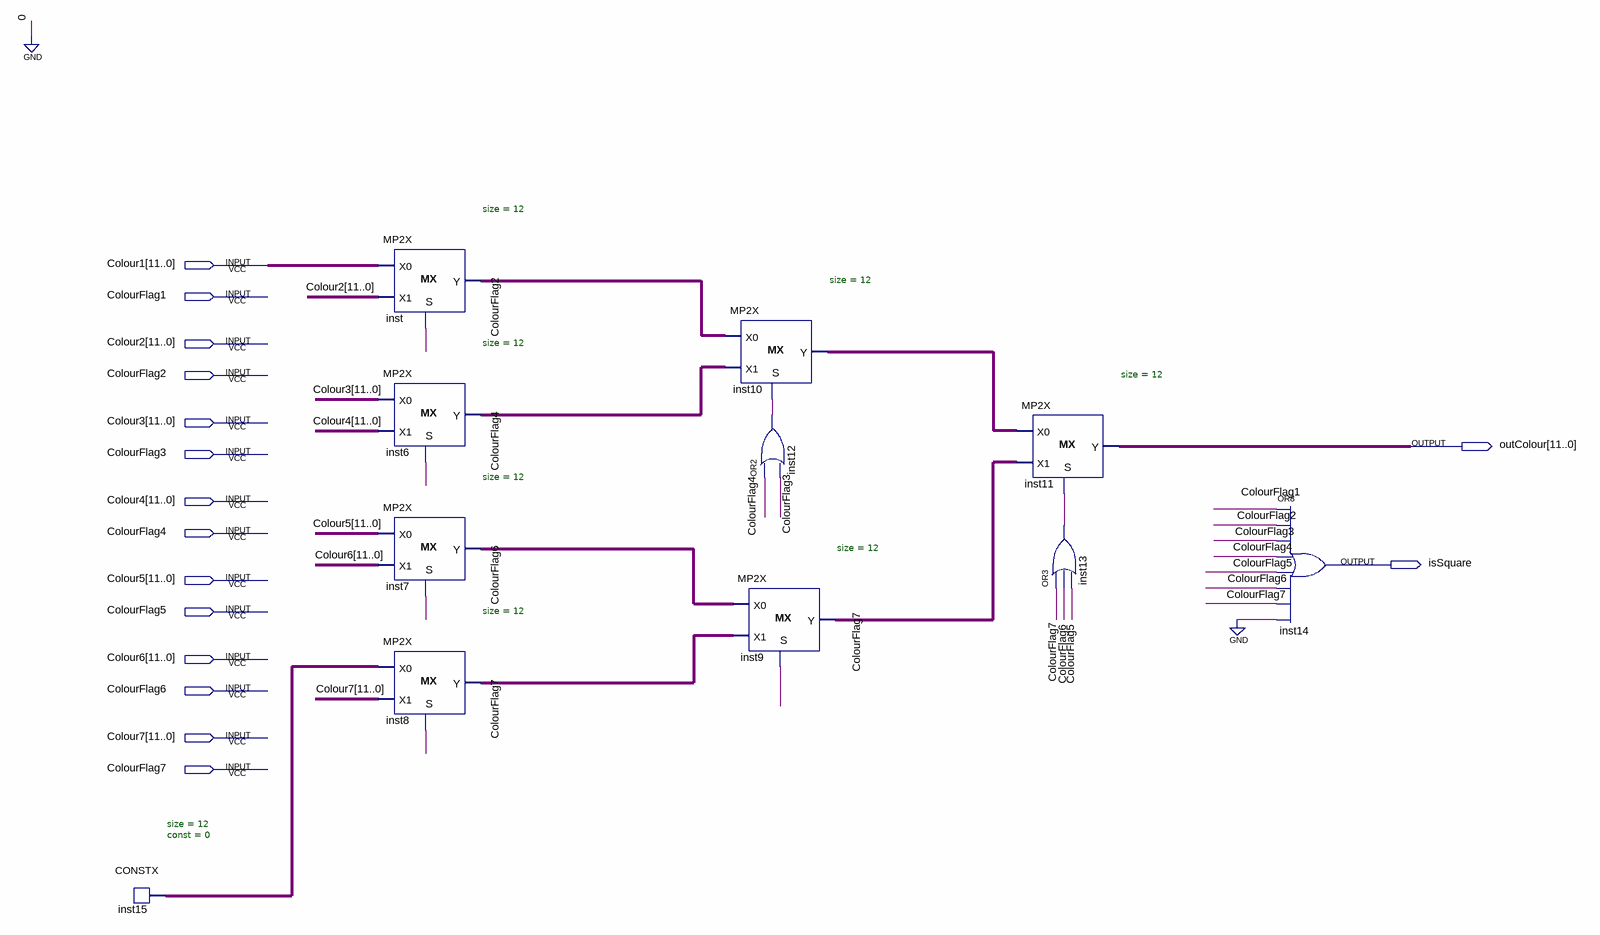
[diagram p0: schematic sheet]
// Quartus schematic MP8.bdf as structural Verilog: 11 symbols, 16 pins
module MP8 (
  input  [11:0] Colour1,
  input  ColourFlag1,
  input  [11:0] Colour2,
  input  ColourFlag2,
  input  [11:0] Colour3,
  input  ColourFlag3,
  input  [11:0] Colour4,
  input  ColourFlag4,
  input  [11:0] Colour5,
  input  ColourFlag5,
  input  [11:0] Colour6,
  input  ColourFlag6,
  input  [11:0] Colour7,
  input  ColourFlag7,
  output [11:0] outColour,
  output isSquare
);

  wire inst12_out, inst13_out;
  wire [11:0] inst6_y, inst7_y, inst8_y, inst9_y, inst10_y, inst15_data, inst_y;

  CONSTX #(.size(12), .\const (0)) inst15 (.data(inst15_data));
  MP2X #(.size(12)) inst (.S(ColourFlag2), .X0(Colour1), .X1(Colour2), .Y(inst_y));
  MP2X #(.size(12)) inst6 (.S(ColourFlag4), .X0(Colour3), .X1(Colour4), .Y(inst6_y));
  MP2X #(.size(12)) inst7 (.S(ColourFlag6), .X0(Colour5), .X1(Colour6), .Y(inst7_y));
  MP2X #(.size(12)) inst8 (.S(ColourFlag7), .X0(inst15_data), .X1(Colour7), .Y(inst8_y));
  MP2X #(.size(12)) inst10 (.S(inst12_out), .X0(inst_y), .X1(inst6_y), .Y(inst10_y));
  or inst12 (inst12_out, ColourFlag4, ColourFlag3);
  MP2X #(.size(12)) inst9 (.S(ColourFlag7), .X0(inst7_y), .X1(inst8_y), .Y(inst9_y));
  MP2X #(.size(12)) inst11 (.S(inst13_out), .X0(inst10_y), .X1(inst9_y), .Y(outColour));
  or inst13 (inst13_out, ColourFlag7, ColourFlag6, ColourFlag5);
  or inst14 (isSquare, ColourFlag1, ColourFlag2, ColourFlag3, ColourFlag4, ColourFlag5, ColourFlag6, ColourFlag7, 1'b0);
endmodule
